# Altium schematic sheet BMP280.SchDoc
size A4
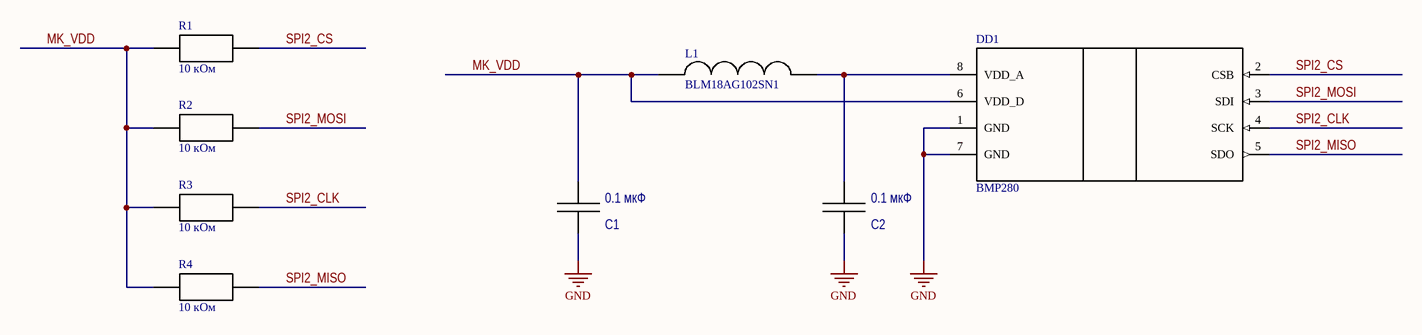
[diagram p0: BMP280.SchDoc]

## Parts
C1  0.1 мкФ  [C 1206]
C2  0.1 мкФ  [C 1206]
DD1  BMP280  [LGA_2.0_2.5_8PIN]
L1  BLM18AG102SN1  [FB 0603]
R1  10 кОм  [RES 0805]
R2  10 кОм  [RES 0805]
R3  10 кОм  [RES 0805]
R4  10 кОм  [RES 0805]

## Nets
GND: C1.2 C2.2 DD1.1(GND) DD1.7(GND)
MK_VDD: C1.1 DD1.6(VDD_D) L1.1 R1.1 R2.1 R3.1 R4.1
SPI2_CLK: DD1.4(SCK) R3.2
SPI2_CS: DD1.2(CSB) R1.2
SPI2_MISO: DD1.5(SDO) R4.2
SPI2_MOSI: DD1.3(SDI) R2.2
NetC2_1: C2.1 DD1.8(VDD_A) L1.2

## Library data of the parts
C1 C2 = CAP 1206: SMD Capacitor 1206; Manufacturer: /Укажите компанию-производителя/; Tolerance: /Укажите допуск в процентах/; Temperature coefficient: /Формат: ±? ppm/°C/; Type: Конденсатор керамический; TC: /Укажите тип диэлектрика/; Size: 1206; Temperature range: /Формат: -? ... ? °C/; Value: 0.1 мкФ
R1-R4 = RES 0805